# Altium schematic sheet PowerSupplyUCM.SchDoc
size A4; SheetNumber: 3; SheetTotal: 4
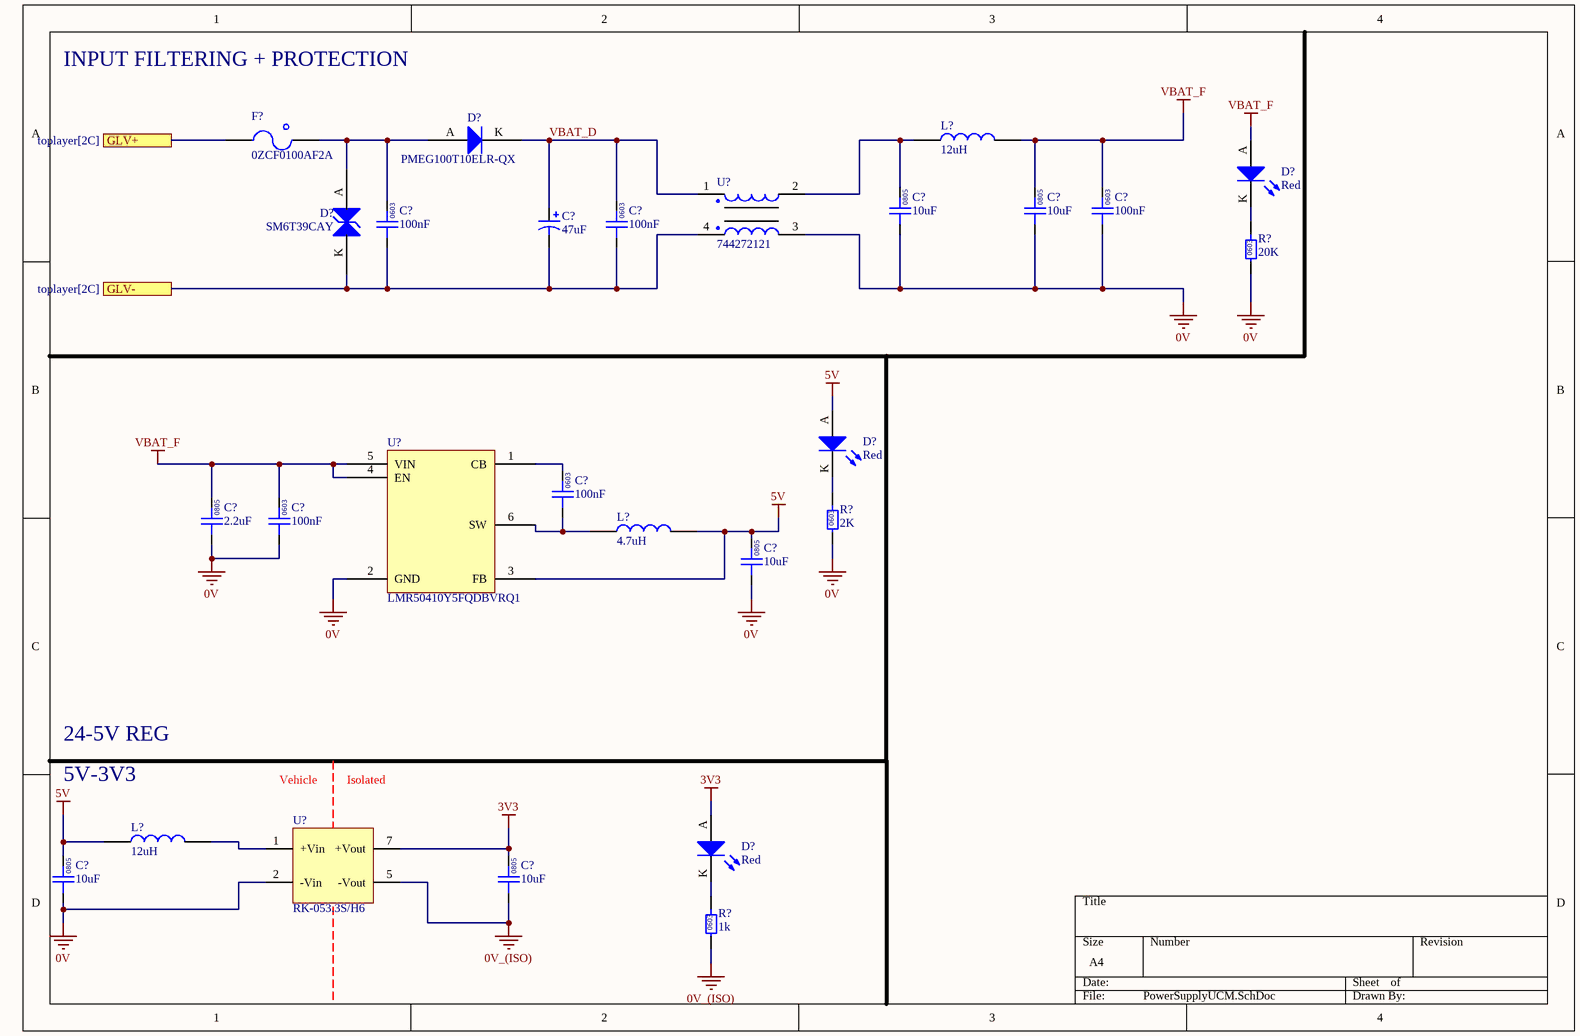
[diagram p0: PowerSupplyUCM.SchDoc]

## Parts
(Parts that share a designator on the sheet are numbered #1, #2 ... from top to bottom, then left to right.)
C?#1  47uF  [CHEMI-CON ELCO]
C?#2  10uF  [0805]
C?#3  10uF  [0805]
C?#4  100nF  [0603]
C?#5  100nF  [0603]
C?#6  100nF  [0603]
C?#7  100nF  [0603]
C?#8  2.2uF  [0805]
C?#9  100nF  [0603]
C?#10  10uF  [0805]
C?#11  10uF  [0805]
C?#12  10uF  [0805]
D?#1  PMEG100T10ELR-QX  [SODFL350X110-2N]
D?#2  Red  [0805 LED]
D?#3  SM6T39CAY  [SM6T39CAY-Footprint-1]
D?#4  Red  [0805 LED]
D?#5  Red  [0805 LED]
F?  0ZCF0100AF2A  [2920]
L?#1  12uH  [1812]
L?#2  4.7uH  [SRN3015TA-4R7M]
L?#3  12uH  [1812]
R?#1  20K  [0603]
R?#2  2K  [0603]
R?#3  1k  [0603]
U?#1  744272121  [Wurth 4-PC Pad]
U?#2  LMR50410Y5FQDBVRQ1  [TI-SOT23-6]
U?#3  RK-053.3S/H6  [RK-053.3S/H6]

## Ports
GLV+ (see toplayer[2C]), GLV- (see toplayer[2C])

## Nets
0V: C?#2.1 C?#3.1 C?#4.1 C?#8.1 C?#9.1 C?#10.1 C?#11.1 R?#1.1 R?#2.1 U?#1.3 U?#2.2(GND) U?#3.2(-Vin)
0V_(ISO): C?#12.1 R?#3.1 U?#3.5(-Vout)
3V3: C?#12.2 D?#5.A U?#3.7(+Vout)
5V: C?#10.2 C?#11.2 D?#4.A L?#2.1 L?#3.2 U?#2.3(FB)
VBAT_F: C?#3.2 C?#4.2 C?#8.2 C?#9.2 D?#2.A L?#1.1 U?#2.4(EN) U?#2.5(VIN)
GLV+: F?.1 ; port GLV+
GLV-: C?#1.1 C?#5.1 C?#6.1 D?#3.K U?#1.4 ; port GLV-
VBAT_D: C?#1.2 C?#6.2 D?#1.K U?#1.1
NetC?#2_2: C?#2.2 L?#1.2 U?#1.2
NetC?#5_2: C?#5.2 D?#1.A D?#3.A F?.2
NetC?#7_1: C?#7.1 L?#2.2 U?#2.6(SW)
NetC?#7_2: C?#7.2 U?#2.1(CB)
NetD?#2_K: D?#2.K R?#1.2
NetD?#4_K: D?#4.K R?#2.2
NetD?#5_K: D?#5.K R?#3.2
NetL?#3_1: L?#3.1 U?#3.1(+Vin)

## Notes on the sheet
- INPUT FILTERING + PROTECTION
- 24-5V REG
- 5V-3V3
- Vehicle
- Isolated
- (in symbol GCM188L81H104KA57D) 0603
- (in symbol GRM21BR6YA106KE43L) 0805
- (in symbol GRM21BR61A226ME51L) 0805
- (in symbol RC0603FR-071KL) 0603
- (in symbol RC0603FR-072KL) 0603
- (in symbol RC0603FR-0720KL) 0603

## Library data of the parts
C?#1 = HHXA350ARA470MF61G: Part Number: HHXA350ARA470MF61G
C?#2 C?#3 C?#10-C?#12 = GRM21BR6YA106KE43L: Manufacturer: muRata; Rated Voltage: 50V; Tolerance: 10%; Material: MLCC; Temperature Rating: X5R; Part Number: GRM21BR6YA106KE43L; Value: 10uF; Digikey Part Number: 490-10514-6-ND
C?#4-C?#7 C?#9 = GCM188L81H104KA57D: Manufacturer: muRata; Rated Voltage: 50V; Tolerance: ±10%; Material: MLCC; Temperature Rating: X8L; Part Number: GCM188L81H104KA57D; Value: 100nF; Digikey Part Number: 490-6049-1-ND
C?#8 = GRM21BR61A226ME51L: Manufacturer: muRata; Value: 22uF; Rated Voltage: 50V; Tolerance: 20%; Material: MLCC; Temperature Rating: X5R; Part Number: GRM21BR61A226ME51L; Digikey Part Number: 490-10511-1-ND
D?#1 = CMP-004-00005-4: Diode 100 V 1A Surface Mount SOD-123W
D?#2 D?#4 D?#5 = SML-210LTT86: Red LED Indication - Discrete 1.75V 0805 (2012 Metric); Manufacturer: ROHM Semiconductor; Part Number: SML-210LTT86; Colour: Red; Digikey Part Number: 511-1286-1-ND
D?#3 = CMP-004-00003-4: TVS Diode Single Bi-Dir 33.3V 600W Automotive 2-Pin SMB T/R / TVS DIODE 33.3VWM 69.7VC SMB; Peak Pulse Current: 57A; Polarity: Bidirectional; Min Breakdown Voltage: 37.1V; Test Current: 1mA; Number of Elements: 1; Operating Supply Voltage: 30V; Diode Type: ZENER; Clamping Voltage: 53.9V; Leakage Current: 200nA; Power Line Protection: No; Max Surge Current: 11.1A; Max Breakdown Voltage: 41V; Breakdown Voltage: 39V; Max Power Dissipation: 600W; Radiation Hardening: No; Resistor Type: Zener; Termination: SMD/SMT; REACH SVHC: No SVHC; Reverse Breakdown Voltage: 37.1V; Max Operating Temperature: 150°C; Min Operating Temperature: -55°C; Element Configuration: Single; Length: 4.6mm; Case/Package: DO-214AA; Reverse Standoff Voltage: 33.3V; Number of Bidirectional Channels: 1; Number of Pins: 2; Direction: Bidirectional; Mount: Surface Mount; Package Quantity: 1; Width: 3.95mm; RoHS Compliant: Yes; Number of Channels: 1; Packaging: Tape and Reel; Max Reverse Leakage Current: 200nA; Peak Pulse Power: 600W; Height: 2.45mm; Series: Automotive, AEC-Q101, SM6TY, TRANSIL™
F? = 0ZCF0100AF2A: PTC RESET FUSE 60V 1A 292; Manufacturer: Littelfuse Inc.; Part Number: 0ZCF0100AF2A; Digikey Part Number: 507-2070-1-ND; Digikey Link: https://www.digikey.com/product-detail/en/bel-fuse-inc/0ZCF0100AF2A/507-2070-1-ND/6210547
L?#1 L?#3 = RLS-126: Manufacturer: Recom; Tolerance: 0.2; Impedance: 230mOhm; Rated Current: 0.8 A; Material: Wirewound; Part Number: RLS-126; Value: 12uH; Digikey Part Number: 945-3429-ND
L?#2 = SRN4018-4R7M: Manufacturer: Bourns; Tolerance: 0.2; Impedance: 84mOhms; Rated Current: 1.9A; Material: Wirewound; Part Number: SRN4018-4R7M; Value: 4.7uH; Digikey Part Number: SRN3015TA-4R7MCT-ND
R?#1 = RC0603FR-0720KL: Manufacturer: YAGEO; Tolerance: 0.01; Rated Power: 0.1W; Part Number: RC0603FR-0720KL; Value: 20K; Digikey Part Number: 311-20.0KHRCT-ND; Material: FR-07
R?#2 = RC0603FR-072KL: Manufacturer: YAGEO; Tolerance: 0.01; Rated Power: 0.1W; Part Number: RC0603FR-072KL; Value: 2K; Digikey Part Number: 311-2.00KHRCT-ND; Material: FR-07
R?#3 = RC0603FR-071KL: Manufacturer: YAGEO; Tolerance: 0.01; Rated Power: 0.1W; Part Number: RC0603FR-071KL; Value: 1k; Digikey Part Number: 311-1.00KHRCT-ND; Material: FR-07
U?#1 = 744272121: Manufacturer: Wurth Electronics Inc; Value: 120uH @ 100kHz; Impedance: 460 Ohms @ 30MHz; Rated Current: 2.5 A; Part Number: 744272121; Material: Wirewound; Digikey Part Number: 732-1489-1-ND
U?#2 = LMR50410-Q1: IC REG BUCK 5V 1A SOT23-6; Manufacturer: Texas Instruments; Input Voltage: 4-36V; Part Number: LMR50410-Q1; Output Voltage: 5V; Output Current: 1A; Digikey Part Number: 296-LMR50410Y5FQDBVRQ1CT-ND
U?#3 = RK-053.3S/H6: DC DC CONVERTER 3.3V 1W; Manufacturer: Recom; Input Voltage: 5V; Output Current: 303mA; Part Number: RK-053.3S/H6; Output Voltage: 3.3V